# EAGLE design PatchPanel (EAGLE 6.2)
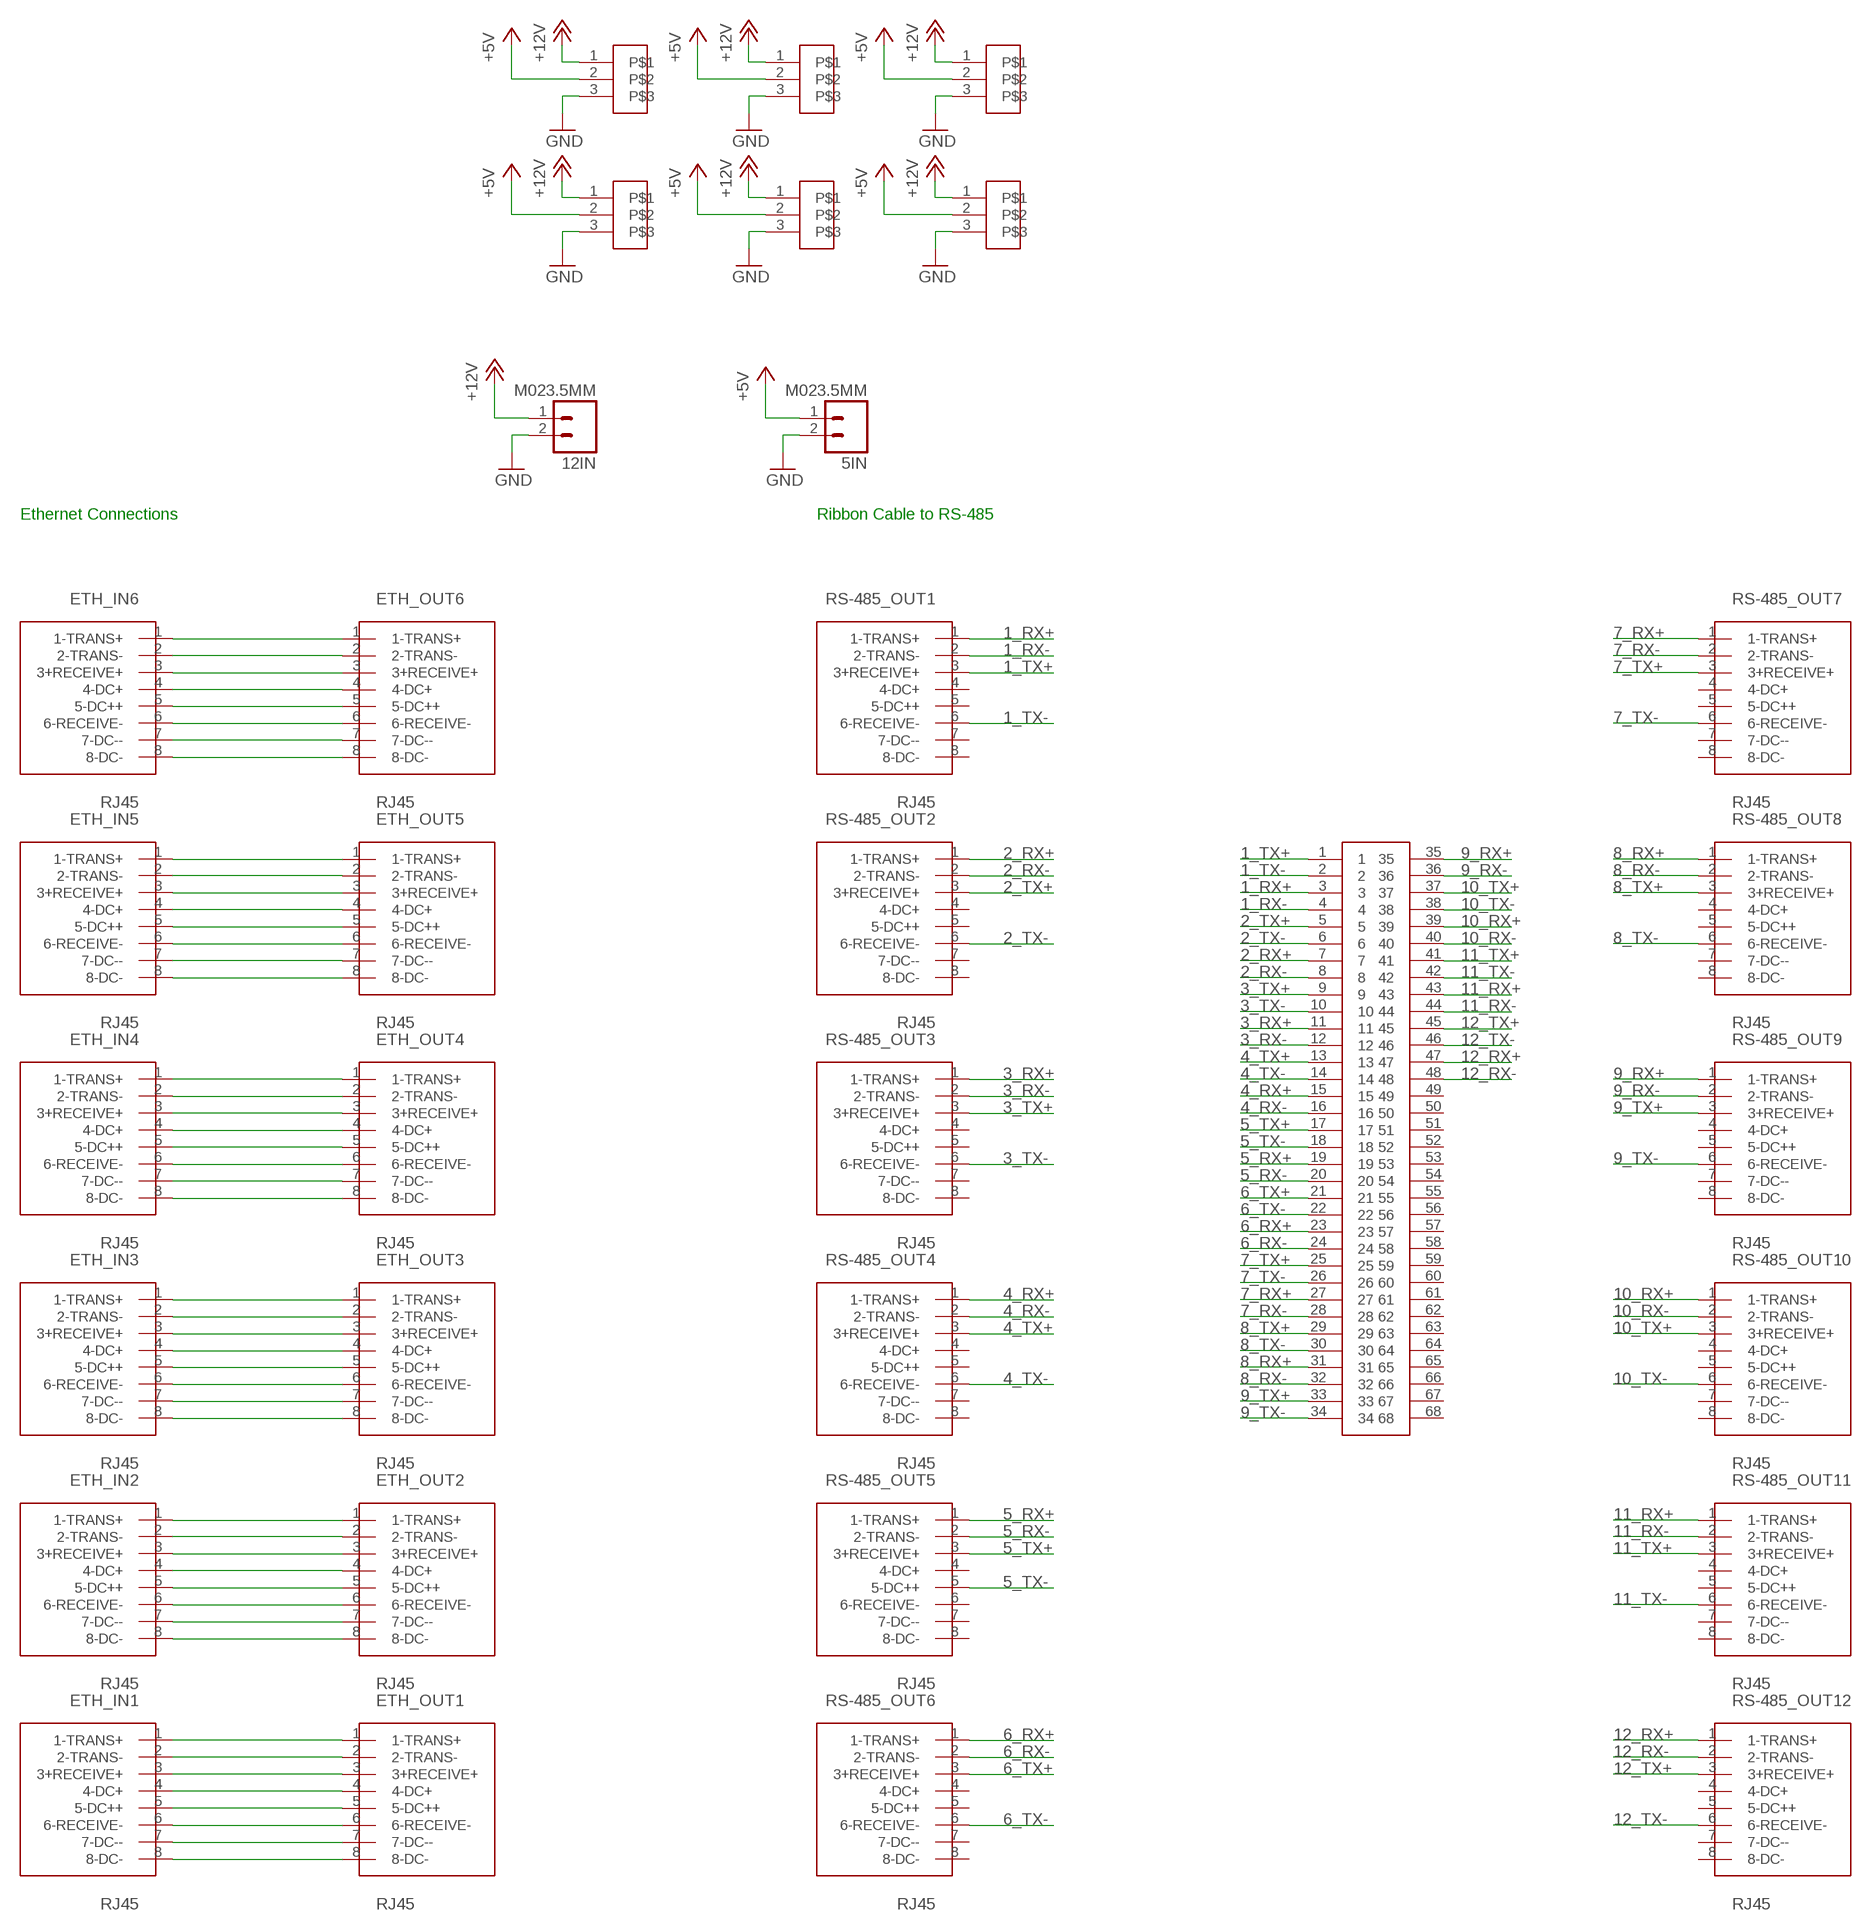
[diagram p0: schematic, sheet 1]

## Parts
5IN  M023.5MM  [SCREWTERMINAL-3.5MM-2]
12IN  M023.5MM  [SCREWTERMINAL-3.5MM-2]
ETH_IN1  RJ45  [RJ45-CAT5E]
ETH_IN2  RJ45  [RJ45-CAT5E]
ETH_IN3  RJ45  [RJ45-CAT5E]
ETH_IN4  RJ45  [RJ45-CAT5E]
ETH_IN5  RJ45  [RJ45-CAT5E]
ETH_IN6  RJ45  [RJ45-CAT5E]
ETH_OUT1  RJ45  [RJ45-CAT5E]
ETH_OUT2  RJ45  [RJ45-CAT5E]
ETH_OUT3  RJ45  [RJ45-CAT5E]
ETH_OUT4  RJ45  [RJ45-CAT5E]
ETH_OUT5  RJ45  [RJ45-CAT5E]
ETH_OUT6  RJ45  [RJ45-CAT5E]
RS-485_OUT1  RJ45  [RJ45-CAT5E]
RS-485_OUT2  RJ45  [RJ45-CAT5E]
RS-485_OUT3  RJ45  [RJ45-CAT5E]
RS-485_OUT4  RJ45  [RJ45-CAT5E]
RS-485_OUT5  RJ45  [RJ45-CAT5E]
RS-485_OUT6  RJ45  [RJ45-CAT5E]
RS-485_OUT7  RJ45  [RJ45-CAT5E]
RS-485_OUT8  RJ45  [RJ45-CAT5E]
RS-485_OUT9  RJ45  [RJ45-CAT5E]
RS-485_OUT10  RJ45  [RJ45-CAT5E]
RS-485_OUT11  RJ45  [RJ45-CAT5E]
RS-485_OUT12  RJ45  [RJ45-CAT5E]
U$1  TB60050685100  [60050685100]
U$2  3PIN  [0.93"]
U$3  3PIN  [0.93"]
U$4  3PIN  [0.93"]
U$5  3PIN  [0.93"]
U$6  3PIN  [0.93"]
U$7  3PIN  [0.93"]

## Nets
1_RX+: RS-485_OUT1.1(1-TRANS+) U$1.3
1_RX-: RS-485_OUT1.2(2-TRANS-) U$1.4
1_TX+: RS-485_OUT1.3(3+RECEIVE+) U$1.1
1_TX-: RS-485_OUT1.6(6-RECEIVE-) U$1.2
2_RX+: RS-485_OUT2.1(1-TRANS+) U$1.7
2_RX-: RS-485_OUT2.2(2-TRANS-) U$1.8
2_TX+: RS-485_OUT2.3(3+RECEIVE+) U$1.5
2_TX-: RS-485_OUT2.6(6-RECEIVE-) U$1.6
3_RX+: RS-485_OUT3.1(1-TRANS+) U$1.11
3_RX-: RS-485_OUT3.2(2-TRANS-) U$1.12
3_TX+: RS-485_OUT3.3(3+RECEIVE+) U$1.9
3_TX-: RS-485_OUT3.6(6-RECEIVE-) U$1.10
4_RX+: RS-485_OUT4.1(1-TRANS+) U$1.15
4_RX-: RS-485_OUT4.2(2-TRANS-) U$1.16
4_TX+: RS-485_OUT4.3(3+RECEIVE+) U$1.13
4_TX-: RS-485_OUT4.6(6-RECEIVE-) U$1.14
5_RX+: RS-485_OUT5.1(1-TRANS+) U$1.19
5_RX-: RS-485_OUT5.2(2-TRANS-) U$1.20
5_TX+: RS-485_OUT5.3(3+RECEIVE+) U$1.17
5_TX-: RS-485_OUT5.5(5-DC++) U$1.18
6_RX+: RS-485_OUT6.1(1-TRANS+) U$1.23
6_RX-: RS-485_OUT6.2(2-TRANS-) U$1.24
6_TX+: RS-485_OUT6.3(3+RECEIVE+) U$1.21
6_TX-: RS-485_OUT6.6(6-RECEIVE-) U$1.22
7_RX+: RS-485_OUT7.1(1-TRANS+) U$1.27
7_RX-: RS-485_OUT7.2(2-TRANS-) U$1.28
7_TX+: RS-485_OUT7.3(3+RECEIVE+) U$1.25
7_TX-: RS-485_OUT7.6(6-RECEIVE-) U$1.26
8_RX+: RS-485_OUT8.1(1-TRANS+) U$1.31
8_RX-: RS-485_OUT8.2(2-TRANS-) U$1.32
8_TX+: RS-485_OUT8.3(3+RECEIVE+) U$1.29
8_TX-: RS-485_OUT8.6(6-RECEIVE-) U$1.30
9_RX+: RS-485_OUT9.1(1-TRANS+) U$1.35
9_RX-: RS-485_OUT9.2(2-TRANS-) U$1.36
9_TX+: RS-485_OUT9.3(3+RECEIVE+) U$1.33
9_TX-: RS-485_OUT9.6(6-RECEIVE-) U$1.34
10_RX+: RS-485_OUT10.1(1-TRANS+) U$1.39
10_RX-: RS-485_OUT10.2(2-TRANS-) U$1.40
10_TX+: RS-485_OUT10.3(3+RECEIVE+) U$1.37
10_TX-: RS-485_OUT10.6(6-RECEIVE-) U$1.38
11_RX+: RS-485_OUT11.1(1-TRANS+) U$1.43
11_RX-: RS-485_OUT11.2(2-TRANS-) U$1.44
11_TX+: RS-485_OUT11.3(3+RECEIVE+) U$1.41
11_TX-: RS-485_OUT11.6(6-RECEIVE-) U$1.42
12_RX+: RS-485_OUT12.1(1-TRANS+) U$1.47
12_RX-: RS-485_OUT12.2(2-TRANS-) U$1.48
12_TX+: RS-485_OUT12.3(3+RECEIVE+) U$1.45
12_TX-: RS-485_OUT12.6(6-RECEIVE-) U$1.46
+5V: 5IN.1 U$2.2 U$3.2 U$4.2 U$5.2 U$6.2 U$7.2
+12V: 12IN.1 U$2.1 U$3.1 U$4.1 U$5.1 U$6.1 U$7.1
GND: 5IN.2 12IN.2 U$2.3 U$3.3 U$4.3 U$5.3 U$6.3 U$7.3
N$1: ETH_IN1.1(1-TRANS+) ETH_OUT1.1(1-TRANS+)
N$2: ETH_IN1.2(2-TRANS-) ETH_OUT1.2(2-TRANS-)
N$3: ETH_IN1.3(3+RECEIVE+) ETH_OUT1.3(3+RECEIVE+)
N$4: ETH_IN1.4(4-DC+) ETH_OUT1.4(4-DC+)
N$5: ETH_IN1.5(5-DC++) ETH_OUT1.5(5-DC++)
N$6: ETH_IN1.6(6-RECEIVE-) ETH_OUT1.6(6-RECEIVE-)
N$7: ETH_IN1.7(7-DC--) ETH_OUT1.7(7-DC--)
N$8: ETH_IN1.8(8-DC-) ETH_OUT1.8(8-DC-)
N$9: ETH_IN2.1(1-TRANS+) ETH_OUT2.1(1-TRANS+)
N$10: ETH_IN2.2(2-TRANS-) ETH_OUT2.2(2-TRANS-)
N$11: ETH_IN2.3(3+RECEIVE+) ETH_OUT2.3(3+RECEIVE+)
N$12: ETH_IN2.4(4-DC+) ETH_OUT2.4(4-DC+)
N$13: ETH_IN2.5(5-DC++) ETH_OUT2.5(5-DC++)
N$14: ETH_IN2.6(6-RECEIVE-) ETH_OUT2.6(6-RECEIVE-)
N$15: ETH_IN2.7(7-DC--) ETH_OUT2.7(7-DC--)
N$16: ETH_IN2.8(8-DC-) ETH_OUT2.8(8-DC-)
N$17: ETH_IN3.1(1-TRANS+) ETH_OUT3.1(1-TRANS+)
N$18: ETH_IN3.2(2-TRANS-) ETH_OUT3.2(2-TRANS-)
N$19: ETH_IN3.3(3+RECEIVE+) ETH_OUT3.3(3+RECEIVE+)
N$20: ETH_IN3.4(4-DC+) ETH_OUT3.4(4-DC+)
N$21: ETH_IN3.5(5-DC++) ETH_OUT3.5(5-DC++)
N$22: ETH_IN3.6(6-RECEIVE-) ETH_OUT3.6(6-RECEIVE-)
N$23: ETH_IN3.7(7-DC--) ETH_OUT3.7(7-DC--)
N$24: ETH_IN3.8(8-DC-) ETH_OUT3.8(8-DC-)
N$25: ETH_IN4.8(8-DC-) ETH_OUT4.8(8-DC-)
N$26: ETH_IN4.7(7-DC--) ETH_OUT4.7(7-DC--)
N$27: ETH_IN4.6(6-RECEIVE-) ETH_OUT4.6(6-RECEIVE-)
N$28: ETH_IN4.5(5-DC++) ETH_OUT4.5(5-DC++)
N$29: ETH_IN4.4(4-DC+) ETH_OUT4.4(4-DC+)
N$30: ETH_IN4.3(3+RECEIVE+) ETH_OUT4.3(3+RECEIVE+)
N$31: ETH_IN4.2(2-TRANS-) ETH_OUT4.2(2-TRANS-)
N$32: ETH_IN4.1(1-TRANS+) ETH_OUT4.1(1-TRANS+)
N$33: ETH_IN5.8(8-DC-) ETH_OUT5.8(8-DC-)
N$34: ETH_IN5.7(7-DC--) ETH_OUT5.7(7-DC--)
N$35: ETH_IN5.6(6-RECEIVE-) ETH_OUT5.6(6-RECEIVE-)
N$36: ETH_IN5.5(5-DC++) ETH_OUT5.5(5-DC++)
N$37: ETH_IN5.4(4-DC+) ETH_OUT5.4(4-DC+)
N$38: ETH_IN5.3(3+RECEIVE+) ETH_OUT5.3(3+RECEIVE+)
N$39: ETH_IN5.2(2-TRANS-) ETH_OUT5.2(2-TRANS-)
N$40: ETH_IN5.1(1-TRANS+) ETH_OUT5.1(1-TRANS+)
N$41: ETH_IN6.1(1-TRANS+) ETH_OUT6.1(1-TRANS+)
N$42: ETH_IN6.2(2-TRANS-) ETH_OUT6.2(2-TRANS-)
N$43: ETH_IN6.3(3+RECEIVE+) ETH_OUT6.3(3+RECEIVE+)
N$44: ETH_IN6.4(4-DC+) ETH_OUT6.4(4-DC+)
N$45: ETH_IN6.5(5-DC++) ETH_OUT6.5(5-DC++)
N$46: ETH_IN6.6(6-RECEIVE-) ETH_OUT6.6(6-RECEIVE-)
N$47: ETH_IN6.7(7-DC--) ETH_OUT6.7(7-DC--)
N$48: ETH_IN6.8(8-DC-) ETH_OUT6.8(8-DC-)
Unconnected: RS-485_OUT1.4(4-DC+) RS-485_OUT1.5(5-DC++) RS-485_OUT1.7(7-DC--) RS-485_OUT1.8(8-DC-) RS-485_OUT2.4(4-DC+) RS-485_OUT2.5(5-DC++) RS-485_OUT2.7(7-DC--) RS-485_OUT2.8(8-DC-) RS-485_OUT3.4(4-DC+) RS-485_OUT3.5(5-DC++) RS-485_OUT3.7(7-DC--) RS-485_OUT3.8(8-DC-) RS-485_OUT4.4(4-DC+) RS-485_OUT4.5(5-DC++) RS-485_OUT4.7(7-DC--) RS-485_OUT4.8(8-DC-) RS-485_OUT5.4(4-DC+) RS-485_OUT5.6(6-RECEIVE-) RS-485_OUT5.7(7-DC--) RS-485_OUT5.8(8-DC-) RS-485_OUT6.4(4-DC+) RS-485_OUT6.5(5-DC++) RS-485_OUT6.7(7-DC--) RS-485_OUT6.8(8-DC-) RS-485_OUT7.4(4-DC+) RS-485_OUT7.5(5-DC++) RS-485_OUT7.7(7-DC--) RS-485_OUT7.8(8-DC-) RS-485_OUT8.4(4-DC+) RS-485_OUT8.5(5-DC++) RS-485_OUT8.7(7-DC--) RS-485_OUT8.8(8-DC-) RS-485_OUT9.4(4-DC+) RS-485_OUT9.5(5-DC++) RS-485_OUT9.7(7-DC--) RS-485_OUT9.8(8-DC-) RS-485_OUT10.4(4-DC+) RS-485_OUT10.5(5-DC++) RS-485_OUT10.7(7-DC--) RS-485_OUT10.8(8-DC-) RS-485_OUT11.4(4-DC+) RS-485_OUT11.5(5-DC++) RS-485_OUT11.7(7-DC--) RS-485_OUT11.8(8-DC-) RS-485_OUT12.4(4-DC+) RS-485_OUT12.5(5-DC++) RS-485_OUT12.7(7-DC--) RS-485_OUT12.8(8-DC-) U$1.49 U$1.50 U$1.51 U$1.52 U$1.53 U$1.54 U$1.55 U$1.56 U$1.57 U$1.58 U$1.59 U$1.60 U$1.61 U$1.62 U$1.63 U$1.64 U$1.65 U$1.66 U$1.67 U$1.68

## Notes on the sheet
- Ethernet Connections | Ribbon Cable to RS-485

## Library data of the parts
5IN 12IN = SparkFun-Connectors:M02: Standard 2-pin 0.1" header. Use with - straight break away headers ( PRT-00116) - right angle break away headers (PRT-00553) - swiss pins (PRT-00743) - machine pins (PRT-00117) - female headers (PRT-00115) Molex polarized connector foot print use with: PRT-08233 with associated crimp pins and housings. 2.54_SCREWTERM for use with PRT-10571. 3.5mm Screw Terminal footprints for PRT-08084 5mm Screw Terminal footprints for use with PRT-08433
ETH_IN1-ETH_IN6 ETH_OUT1-ETH_OUT6 RS-485_OUT1-RS-485_OUT12 = PCB0M1:RJ45
U$1 = harting-scsi:TB60050685100
U$2-U$7 = molex-power:3PIN

## Board
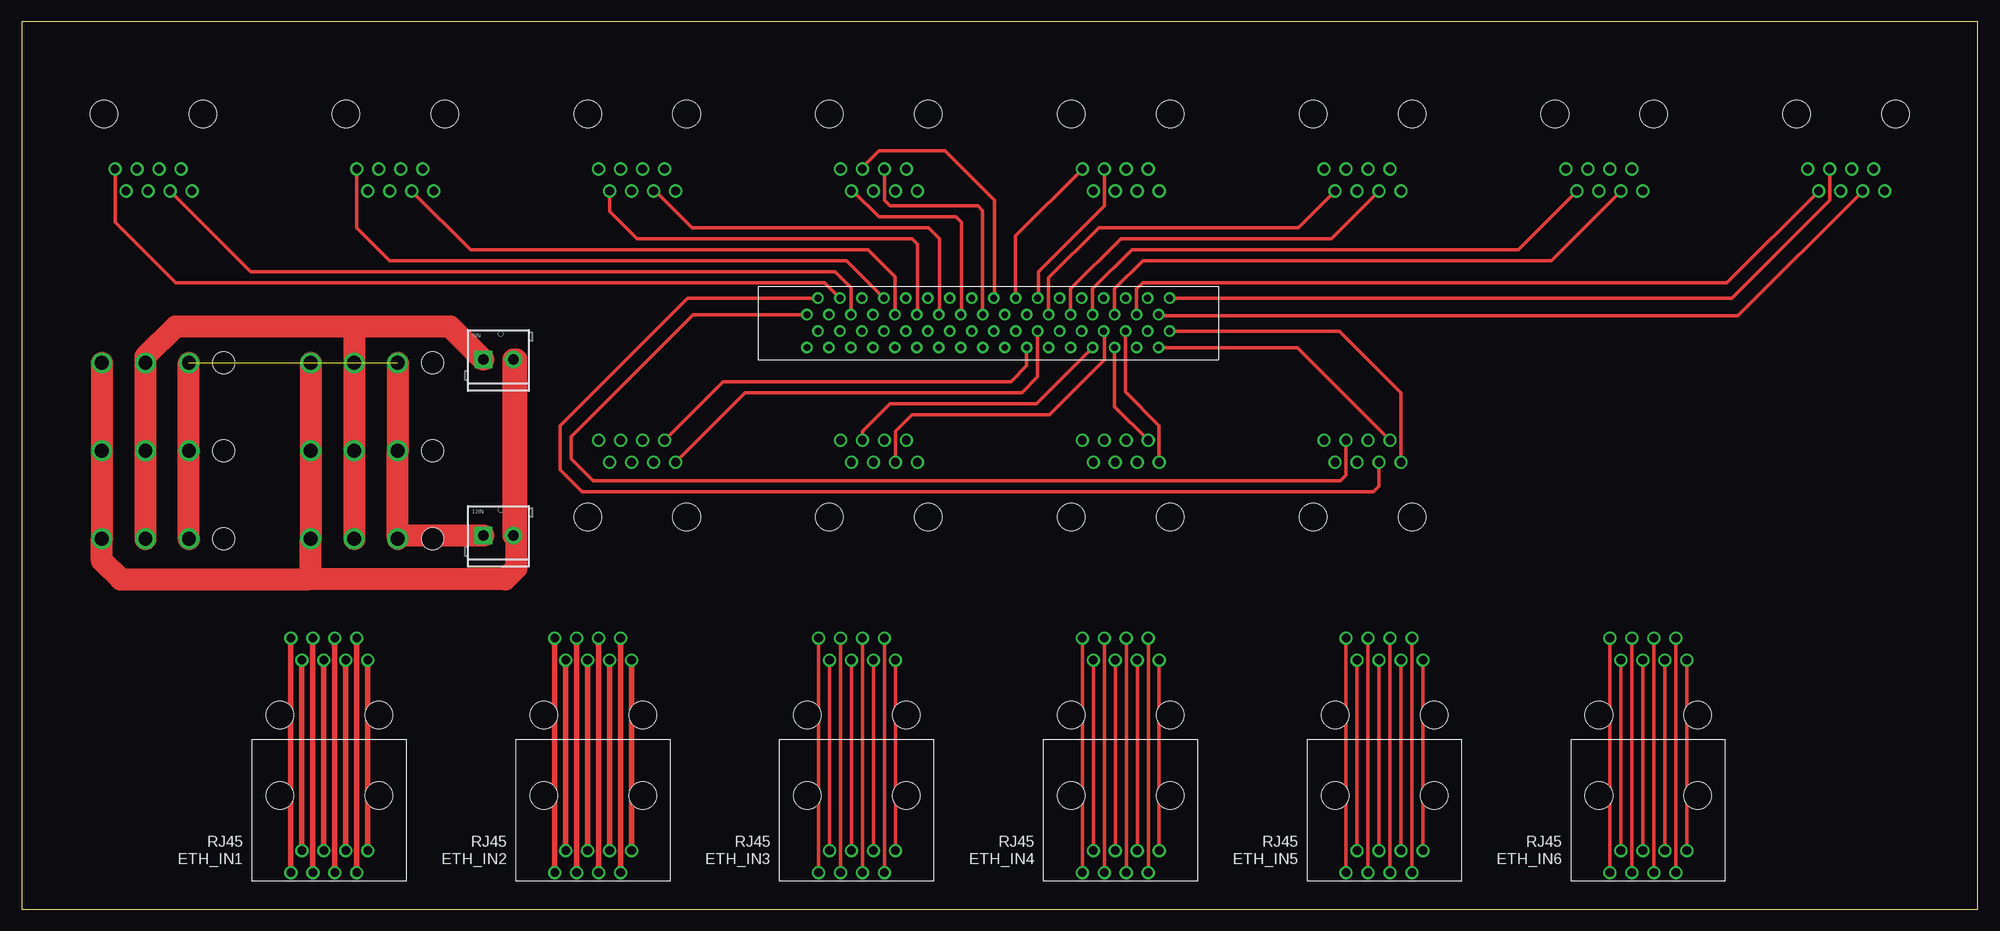
[diagram p1: board, top side]
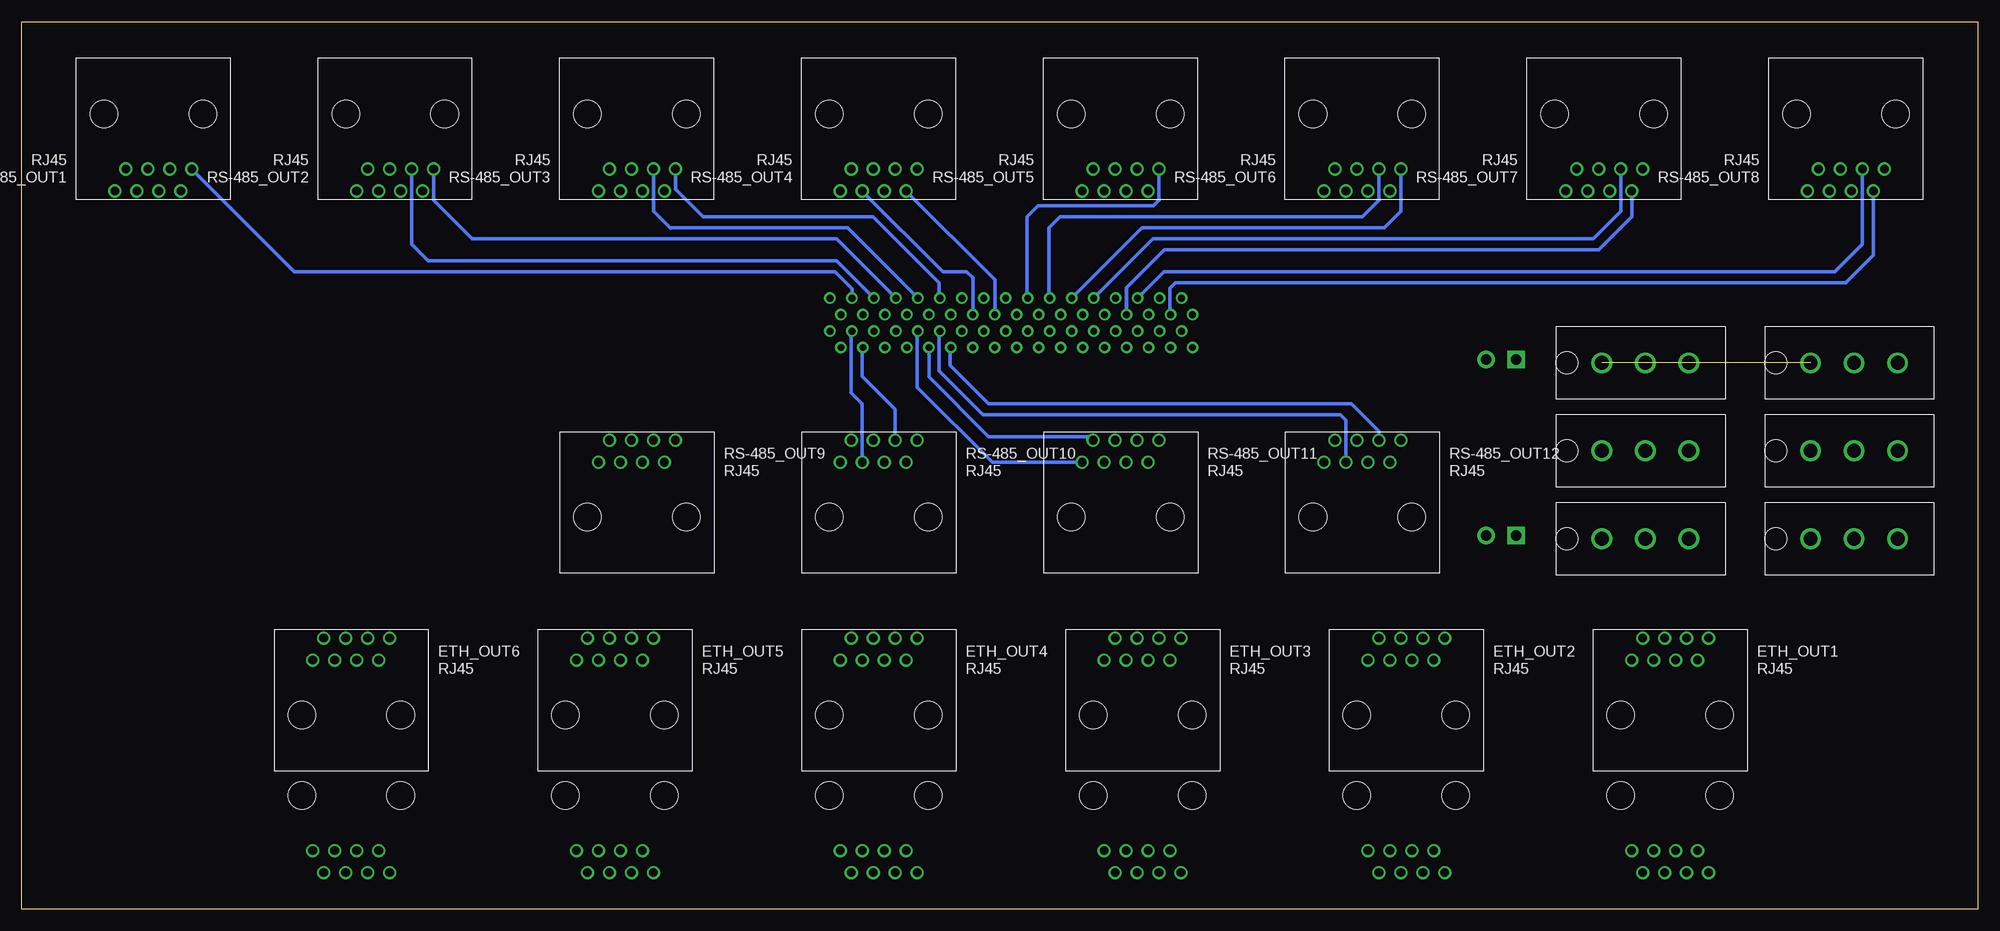
[diagram p2: board, bottom side, seen from below]

Size 226.04 x 102.54 mm. Coordinates in mm from the lower left corner, seen from the top.
Outline: 0,0 226.04,0 226.04,102.54 0,102.54 0,0
Copper layers (1*16): Top 0.035mm / dielectric 1.5mm / Bottom 0.035mm
Design rules: minimum track width 10mil, minimum drill 24mil, track to track 8mil, track to pad 8mil, pad to pad 8mil, via to via 8mil, smd to smd 8mil, copper to edge 40mil, drill to drill 8mil, minimum pad ring 10mil, minimum via ring 8mil, stop-mask expansion 4mil, vias tented up to drill 0mil, thermal gap 10mil

### Footprints (pad centres in the part's own frame; a part is rotated, then mirrored left to right if it is on the bottom)
SCREWTERMINAL-3.5MM-2 = drill 1.2 pad 2.032 square: 1 0,0 | drill 1.2 pad 2.032: 2 3.5,0
RJ45-CAT5E = drill 1: 1 -4.445,4.655; 2 -3.175,7.195; 3 -1.905,4.655; 4 -0.635,7.195; 5 0.635,4.655; 6 1.905,7.195; 7 3.175,4.655; 8 4.445,7.195 | hole 3.2: 5.715,-1.695; -5.715,-1.695
60050685100 = drill 0.8: 1 47.555,7.107; 2 46.285,5.202; 3 45.015,7.107; 4 43.745,5.202; 5 42.475,7.107; 6 41.205,5.202; 7 39.935,7.107; 8 38.665,5.202; 9 37.395,7.107; 10 36.125,5.202; 11 34.855,7.107; 12 33.585,5.202; 13 32.315,7.107; 14 31.045,5.202; 15 29.775,7.107; 16 28.505,5.202; 17 27.235,7.107; 18 25.965,5.202; 19 24.695,7.107; 20 23.425,5.202; 21 22.155,7.107; 22 20.885,5.202; 23 19.615,7.107; 24 18.345,5.202; 25 17.075,7.107; 26 15.805,5.202; 27 14.535,7.107; 28 13.265,5.202; 29 11.995,7.107; 30 10.725,5.202; 31 9.455,7.107; 32 8.185,5.202; 33 6.915,7.107; 34 5.645,5.202; 35 47.555,3.297; 36 46.285,1.393; 37 45.015,3.297; 38 43.745,1.393; 39 42.475,3.297; 40 41.205,1.393; 41 39.935,3.297; 42 38.665,1.393; 43 37.395,3.297; 44 36.125,1.393; 45 34.855,3.297; 46 33.585,1.393; 47 32.315,3.297; 48 31.045,1.393; 49 29.775,3.297; 50 28.505,1.393; 51 27.235,3.297; 52 25.965,1.393; 53 24.695,3.297; 54 23.425,1.393; 55 22.155,3.297; 56 20.885,1.393; 57 19.615,3.297; 58 18.345,1.393; 59 17.075,3.297; 60 15.805,1.393; 61 14.535,3.297; 62 13.265,1.393; 63 11.995,3.297; 64 10.725,1.393; 65 9.455,3.297; 66 8.185,1.393; 67 6.915,3.297; 68 5.645,1.393
0.93" = drill 1.6: 1 14.249,4.191; 2 9.22,4.191; 3 4.191,4.191 | hole 2.54: 18.263,4.191

### Placement (x,y rotation side)
5IN  53.34,63.5 0 top
12IN  53.34,43.18 0 top
ETH_IN1  35.56,11.43 180 top
ETH_IN2  66.04,11.43 180 top
ETH_IN3  96.52,11.43 180 top
ETH_IN4  127,11.43 180 top
ETH_IN5  157.48,11.43 180 top
ETH_IN6  187.96,11.43 180 top
ETH_OUT1  35.56,24.13 0 bottom
ETH_OUT2  66.04,24.13 0 bottom
ETH_OUT3  96.52,24.13 0 bottom
ETH_OUT4  127,24.13 0 bottom
ETH_OUT5  157.48,24.13 0 bottom
ETH_OUT6  187.96,24.13 0 bottom
RS-485_OUT1  210.82,90.17 180 bottom
RS-485_OUT2  182.88,90.17 180 bottom
RS-485_OUT3  154.94,90.17 180 bottom
RS-485_OUT4  127,90.17 180 bottom
RS-485_OUT5  99.06,90.17 180 bottom
RS-485_OUT6  71.12,90.17 180 bottom
RS-485_OUT7  43.18,90.17 180 bottom
RS-485_OUT8  15.24,90.17 180 bottom
RS-485_OUT9  154.94,46.99 0 bottom
RS-485_OUT10  127,46.99 0 bottom
RS-485_OUT11  99.06,46.99 0 bottom
RS-485_OUT12  71.12,46.99 0 bottom
U$1  85.09,63.5 0 top
U$2  5.08,67.31 180 bottom
U$3  29.21,67.31 180 bottom
U$4  5.08,57.15 180 bottom
U$5  29.21,57.15 180 bottom
U$6  5.08,46.99 180 bottom
U$7  29.21,46.99 180 bottom

### Tracks (layer width: path | path; a pad name or v marks a point on that pad's centre or on a via)
1_RX+
  Bottom 0.406: RS-485_OUT1.1 194.52,73.66 132.08,73.66 130.1,71.69 U$1.3
1_RX-
  Top 0.406: RS-485_OUT1.2 197.06,72.39 129.54,72.39 128.84,71.69 U$1.4
1_TX+
  Top 0.406: RS-485_OUT1.3 208.91,81.92 197.61,70.61 U$1.1
1_TX-
  Top 0.406: RS-485_OUT1.6 198.33,68.58 132.08,68.58 131.96,68.7 U$1.2
2_RX+
  Bottom 0.406: U$1.7 131.89,77.47 173.99,77.47 178.44,81.92 RS-485_OUT2.1
2_RX-
  Top 0.406: RS-485_OUT2.2 172.93,76.2 128.27,76.2 123.75,71.69 U$1.8
2_TX+
  Bottom 0.406: U$1.5 131.89,74.93 179.07,74.93 180.97,76.83 RS-485_OUT2.3
2_TX-
  Top 0.406: RS-485_OUT2.6 176.74,74.93 129.54,74.93 126.3,71.69 U$1.6
3_RX+
  Bottom 0.406: U$1.11 120.02,70.68 120.02,72.39 127.64,80.01 147.32,80.01 150.5,83.19 RS-485_OUT3.1
3_RX-
  Top 0.406: RS-485_OUT3.2 147.53,78.74 124.46,78.74 118.67,72.95 U$1.12
3_TX+
  Bottom 0.406: U$1.9 130.62,78.74 151.13,78.74 153.03,80.64 RS-485_OUT3.3
3_TX-
  Top 0.406: RS-485_OUT3.6 151.34,77.47 127,77.47 121.22,71.69 U$1.10
4_RX+
  Top 0.406: RS-485_OUT4.1 114.86,77.83 U$1.15
4_RX-
  Bottom 0.406: RS-485_OUT4.2 113.59,72.75 U$1.16
4_TX+
  Top 0.406: U$1.13 117.47,70.68 117.47,73.66 125.09,81.28 RS-485_OUT4.3
4_TX-
  Bottom 0.406: RS-485_OUT4.6 119.59,73.66 116.84,73.66 116.14,72.95 U$1.14
5_RX+
  Bottom 0.406: U$1.19 109.86,70.68 109.86,80.01 108.58,81.28 95.25,81.28 94.61,81.92 RS-485_OUT5.1
5_RX-
  Top 0.406: U$1.20 108.58,68.77 108.58,79.38 107.95,80.01 99.06,80.01 96.09,82.97 RS-485_OUT5.2
5_TX+
  Top 0.406: U$1.17 112.39,70.68 112.39,81.92 106.68,87.63 99.06,87.63 97.16,85.72 RS-485_OUT5.3
5_TX-
  Top 0.406: RS-485_OUT5.5 99.69,81.92 100.33,81.28 110.49,81.28 111.06,80.72 U$1.18
6_RX+
  Bottom 0.406: U$1.23 96.57,78.74 68.58,78.74 66.67,80.64 RS-485_OUT6.1
6_RX-
  Top 0.406: U$1.24 103.5,68.77 103.5,76.83 102.87,77.47 71.12,77.47 67.94,80.64 RS-485_OUT6.2
6_TX+
  Bottom 0.406: U$1.21 107.31,70.68 107.31,78.74 106.05,80.01 71.12,80.01 69.22,81.92 RS-485_OUT6.3
6_TX-
  Top 0.406: U$1.22 106.05,68.77 106.05,77.47 104.78,78.74 77.47,78.74 73.23,82.97 RS-485_OUT6.6
7_RX+
  Top 0.406: U$1.27 95.3,74.93 42.55,74.93 38.73,78.74 RS-485_OUT7.1
7_RX-
  Bottom 0.406: RS-485_OUT7.2 40.01,80.01 43.81,76.2 93.98,76.2 98.36,71.83 U$1.28
7_TX+
  Bottom 0.406: U$1.25 95.3,77.47 44.45,77.47 41.27,80.64 RS-485_OUT7.3
7_TX-
  Top 0.406: RS-485_OUT7.6 51.86,76.2 97.79,76.2 100.89,73.09 U$1.26
8_RX+
  Top 0.406: U$1.31 92.76,72.39 17.78,72.39 10.79,79.38 RS-485_OUT8.1
8_RX-
  Bottom 0.406: U$1.32 93.34,68.77 93.34,71.75 92.71,72.39 15.24,72.39 12.06,75.56 RS-485_OUT8.2
8_TX+
  Bottom 0.406: U$1.29 94.03,73.66 16.51,73.66 13.34,76.83 RS-485_OUT8.3
8_TX-
  Top 0.406: RS-485_OUT8.6 26.46,73.66 93.98,73.66 95.81,71.83 U$1.30
9_RX+
  Top 0.406: RS-485_OUT9.1 159.38,59.69 152.28,66.8 U$1.35
9_RX-
  Top 0.406: RS-485_OUT9.2 147.41,64.89 U$1.36
9_TX+
  Top 0.406: RS-485_OUT9.3 156.84,48.9 156.21,48.26 64.77,48.26 62.23,50.8 62.23,55.88 76.96,70.61 U$1.33
9_TX-
  Top 0.406: RS-485_OUT9.6 153.03,50.16 152.4,49.53 66.04,49.53 63.5,52.07 63.5,54.61 77.59,68.7 U$1.34
10_RX+
  Top 0.406: RS-485_OUT10.1 131.44,55.88 127.56,59.76 U$1.39
10_RX-
  Top 0.406: RS-485_OUT10.2 126.3,58.06 U$1.40
10_TX+
  Bottom 0.406: U$1.37 130.18,66.73 130.18,59.69 128.91,58.42 RS-485_OUT10.3
10_TX-
  Bottom 0.406: U$1.38 128.91,64.82 128.91,61.59 125.09,57.78 RS-485_OUT10.6
11_RX+
  Bottom 0.406: U$1.43 122.56,66.73 122.56,60.33 113.88,51.65 RS-485_OUT11.1
11_RX-
  Bottom 0.406: RS-485_OUT11.2 102.66,54.61 114.3,54.61 121.22,61.52 U$1.44
11_TX+
  Top 0.406: U$1.41 125.09,66.73 125.09,63.5 118.75,57.15 102.87,57.15 100.97,55.24 RS-485_OUT11.3
11_TX-
  Top 0.406: U$1.42 117.28,58.42 100.33,58.42 97.16,55.24 RS-485_OUT11.6
12_RX+
  Top 0.406: RS-485_OUT12.1 83.61,59.69 115.57,59.69 117.41,61.52 U$1.47
12_RX-
  Top 0.406: RS-485_OUT12.2 81.07,60.96 114.3,60.96 116.14,62.8 U$1.48
12_TX+
  Bottom 0.406: U$1.45 120.02,66.73 120.02,62.23 114.94,57.15 73.66,57.15 73.03,56.52 RS-485_OUT12.3
12_TX-
  Bottom 0.406: U$1.46 118.75,64.82 118.75,62.87 114.3,58.42 72.39,58.42 69.22,55.24 RS-485_OUT12.6
+5V
  Top 2.54: U$6.2 U$4.2 U$2.2 14.3,63.83 17.78,67.31 38.43,67.31 | U$7.2 U$5.2 U$3.2 38.43,67.31 | 5IN.1 49.53,67.31 38.43,67.31
+12V  (1 unrouted)
  Top 2.54: U$6.1 U$4.1 U$2.1 | U$3.1 U$5.1 U$7.1 43.84,43.18 12IN.1
GND
  Top 2.54: U$2.3 U$4.3 U$6.3 9.27,40.26 11.43,38.1 33.02,38.1 | U$3.3 U$5.3 U$7.3 33.4,38.48 33.02,38.1 | 12IN.2 5IN.2 57.15,63.5 57.15,39.37 55.88,38.1 33.02,38.1
N$1
  Top 0.61: ETH_OUT1.1 ETH_IN1.1
N$2
  Top 0.61: ETH_OUT1.2 ETH_IN1.2
N$3
  Top 0.61: ETH_OUT1.3 ETH_IN1.3
N$4
  Top 0.61: ETH_OUT1.4 ETH_IN1.4
N$5
  Top 0.61: ETH_OUT1.5 ETH_IN1.5
N$6
  Top 0.61: ETH_OUT1.6 ETH_IN1.6
N$7
  Top 0.61: ETH_OUT1.7 ETH_IN1.7
N$8
  Top 0.61: ETH_IN1.8 ETH_OUT1.8
N$9
  Top 0.61: ETH_OUT2.1 ETH_IN2.1
N$10
  Top 0.61: ETH_IN2.2 ETH_OUT2.2
N$11
  Top 0.61: ETH_OUT2.3 ETH_IN2.3
N$12
  Top 0.61: ETH_IN2.4 ETH_OUT2.4
N$13
  Top 0.61: ETH_OUT2.5 ETH_IN2.5
N$14
  Top 0.61: ETH_OUT2.6 ETH_IN2.6
N$15
  Top 0.61: ETH_IN2.7 ETH_OUT2.7
N$16
  Top 0.61: ETH_OUT2.8 ETH_IN2.8
N$17
  Top 0.406: ETH_IN3.1 ETH_OUT3.1
N$18
  Top 0.406: ETH_OUT3.2 ETH_IN3.2
N$19
  Top 0.406: ETH_IN3.3 ETH_OUT3.3
N$20
  Top 0.406: ETH_OUT3.4 ETH_IN3.4
N$21
  Top 0.406: ETH_OUT3.5 ETH_IN3.5
N$22
  Top 0.406: ETH_OUT3.6 ETH_IN3.6
N$23
  Top 0.406: ETH_OUT3.7 ETH_IN3.7
N$24
  Top 0.406: ETH_OUT3.8 ETH_IN3.8
N$25
  Top 0.406: ETH_IN4.8 ETH_OUT4.8
N$26
  Top 0.406: ETH_OUT4.7 ETH_IN4.7
N$27
  Top 0.406: ETH_IN4.6 ETH_OUT4.6
N$28
  Top 0.406: ETH_OUT4.5 ETH_IN4.5
N$29
  Top 0.406: ETH_IN4.4 ETH_OUT4.4
N$30
  Top 0.406: ETH_OUT4.3 ETH_IN4.3
N$31
  Top 0.406: ETH_IN4.2 ETH_OUT4.2
N$32
  Top 0.406: ETH_OUT4.1 ETH_IN4.1
N$33
  Top 0.406: ETH_OUT5.8 ETH_IN5.8
N$34
  Top 0.406: ETH_IN5.7 ETH_OUT5.7
N$35
  Top 0.406: ETH_OUT5.6 ETH_IN5.6
N$36
  Top 0.406: ETH_OUT5.5 ETH_IN5.5
N$37
  Top 0.406: ETH_IN5.4 ETH_OUT5.4
N$38
  Top 0.406: ETH_OUT5.3 ETH_IN5.3
N$39
  Top 0.406: ETH_IN5.2 ETH_OUT5.2
N$40
  Top 0.406: ETH_OUT5.1 ETH_IN5.1
N$41
  Top 0.406: ETH_OUT6.1 ETH_IN6.1
N$42
  Top 0.406: ETH_IN6.2 ETH_OUT6.2
N$43
  Top 0.406: ETH_OUT6.3 ETH_IN6.3
N$44
  Top 0.406: ETH_IN6.4 ETH_OUT6.4
N$45
  Top 0.406: ETH_OUT6.5 ETH_IN6.5
N$46
  Top 0.406: ETH_IN6.6 ETH_OUT6.6
N$47
  Top 0.406: ETH_OUT6.7 ETH_IN6.7
N$48
  Top 0.406: ETH_IN6.8 ETH_OUT6.8